# Altium schematic sheet Sheet7.SchDoc
size A4
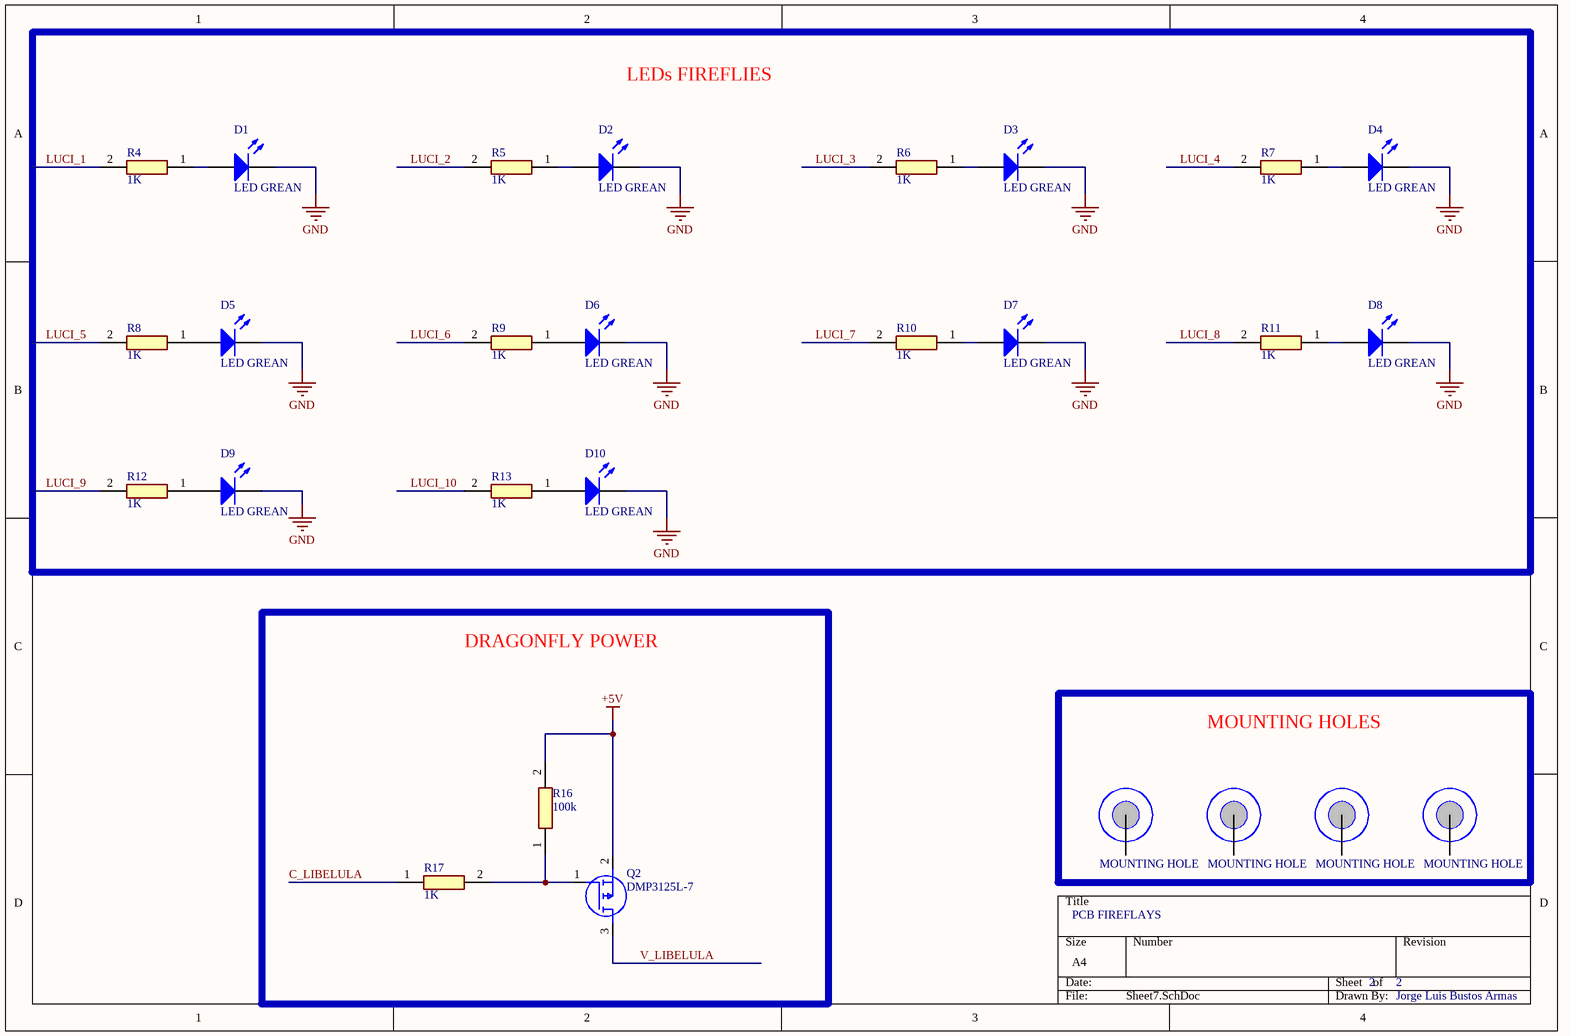
[diagram p0: Sheet7.SchDoc]

## Parts
D1  LED GREAN  [LED 5mm]
D2  LED GREAN  [LED 5mm]
D3  LED GREAN  [LED 5mm]
D4  LED GREAN  [LED 5mm]
D5  LED GREAN  [LED 5mm]
D6  LED GREAN  [LED 5mm]
D7  LED GREAN  [LED 5mm]
D8  LED GREAN  [LED 5mm]
D9  LED GREAN  [LED 5mm]
D10  LED GREAN  [LED 5mm]
MH1  MOUNTING HOLE  [MH]  (no BOM)
MH2  MOUNTING HOLE  [MH]  (no BOM)
MH3  MOUNTING HOLE  [MH]  (no BOM)
MH4  MOUNTING HOLE  [MH]  (no BOM)
Q2  DMP3125L-7  [SOT96P240X110-3N]
R4  1K  [RESC1608X55N]
R5  1K  [RESC1608X55N]
R6  1K  [RESC1608X55N]
R7  1K  [RESC1608X55N]
R8  1K  [RESC1608X55N]
R9  1K  [RESC1608X55N]
R10  1K  [RESC1608X55N]
R11  1K  [RESC1608X55N]
R12  1K  [RESC1608X55N]
R13  1K  [RESC1608X55N]
R16  100k  [RESC1608X55N]
R17  1K  [RESC1608X55N]

## Blocks framed on the sheet
LEDs FIREFLIES: D1-D10 R4-R13
DRAGONFLY POWER: Q2 R16 R17
MOUNTING HOLES: MH1-MH4

## Nets
+5V: Q2.2(S) R16.2
GND: D1.2(K) D2.2(K) D3.2(K) D4.2(K) D5.2(K) D6.2(K) D7.2(K) D8.2(K) D9.2(K) D10.2(K)
C_LIBELULA: R17.1
LUCI_1: R4.2
LUCI_2: R5.2
LUCI_3: R6.2
LUCI_4: R7.2
LUCI_5: R8.2
LUCI_6: R9.2
LUCI_7: R10.2
LUCI_8: R11.2
LUCI_9: R12.2
LUCI_10: R13.2
V_LIBELULA: Q2.3(D)
NetD1_1: D1.1(A) R4.1
NetD2_1: D2.1(A) R5.1
NetD3_1: D3.1(A) R6.1
NetD4_1: D4.1(A) R7.1
NetD5_1: D5.1(A) R8.1
NetD6_1: D6.1(A) R9.1
NetD7_1: D7.1(A) R10.1
NetD8_1: D8.1(A) R11.1
NetD9_1: D9.1(A) R12.1
NetD10_1: D10.1(A) R13.1
NetQ2_1: Q2.1(G) R16.1 R17.2

Not connected (* = marked no-connect by the designer): MH1 ?1; MH2 ?1; MH3 ?1; MH4 ?1

## Notes on the sheet
- PCB FIREFLAYS
- 2
- Jorge Luis Bustos Armas

## Library data of the parts
D1-D10 = LED1: Typical GREAN LED; Published: 8-Jun-2000; LatestRevisionDate: 08-Jul-2005; LatestRevisionNote: Mech Layer 1 removed.; PackageReference: LED-1; Publisher: Altium Limited; PackageDescription: LED; 2 Leads
Q2 = DMP3125L-7: MOSFET (P-Channel); Manufacturer_Name: Diodes Incorporated; Datasheet Link: https://www.diodes.com//assets/Datasheets/DMP3125L.pdf; Height: 1.1mm; Manufacturer_Part_Number: DMP3125L-7; Mouser Part Number: 621-DMP3125L-7; Mouser Price/Stock: https://www.mouser.co.uk/ProductDetail/Diodes-Incorporated/DMP3125L-7?qs=W0yvOO0ixfH8ma8MdHfXQA%3D%3D; Arrow Part Number: DMP3125L-7; Arrow Price/Stock: https://www.arrow.com/en/products/dmp3125l-7/diodes-incorporated?region=nac
R4-R13 R16 R17 = KTR03EZPF1501: Resistor; Manufacturer_Name: ROHM Semiconductor; Datasheet Link: http://rohmfs.rohm.com/en/products/databook/datasheet/passive/resistor/chip_resistor/ktr.pdf; Height: 0.55mm; Manufacturer_Part_Number: KTR03EZPF1501; Mouser Part Number: 755-KTR03EZPF1501; Mouser Price/Stock: https://www.mouser.com/Search/Refine.aspx?Keyword=755-KTR03EZPF1501